# EAGLE design encoder_cable_breakout (EAGLE 7.6.0)
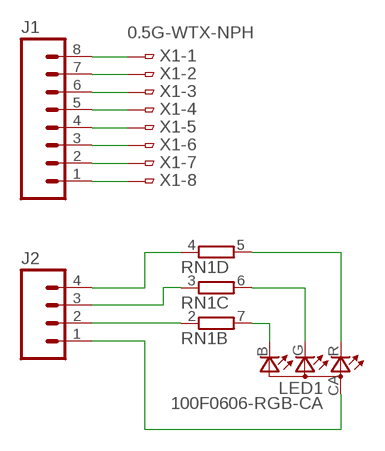
[diagram p0: schematic, sheet 1]

## Parts
J1  M08SILK_FEMALE_PTH  [1X08]
J2  M04PTH  [1X04]
LED1  100F0606-RGB-CA  [1616]
RN1  4R-NYC124  [YC124]
X1  0.5G-WTX-NPH  [0.5G-WTX-NP]

## Nets
N$1: J1.8 X1.1
N$2: J1.7 X1.2
N$3: J1.6 X1.3
N$4: J1.5 X1.4
N$5: J1.4 X1.5
N$6: J1.3 X1.6
N$7: J1.2 X1.7
N$8: J1.1 X1.8
N$9: J2.3 RN1.3
N$10: J2.2 RN1.2
N$11: J2.4 RN1.4
N$12: J2.1 LED1.CA
N$13: LED1.R RN1.5
N$14: LED1.G RN1.6
N$15: LED1.B RN1.7
Unconnected: RN1.1 RN1.8

## Library data of the parts
J1 = SparkFun-Connectors:M08: Header 8 Standard 8-pin 0.1" header. Use with straight break away headers (SKU : PRT-00116), right angle break away headers (PRT-00553), swiss pins (PRT-00743), machine pins (PRT-00117), and female headers (PRT-00115).; PROD_ID: CONN-08438
J2 = SparkFun-Connectors:M04: Header 4 Standard 4-pin 0.1" header. Use with straight break away headers (SKU : PRT-00116), right angle break away headers (PRT-00553), swiss pins (PRT-00743), machine pins (PRT-00117), and female headers (PRT-00115). Molex polarized connector foot print use with SKU : PRT-08231 with associated crimp pins and housings. 1MM SMD Version SKU: PRT-10208; PROD_ID: CONN-09696
LED1 = 100F0606-RGB-CA:100F0606-RGB-CA: Common-anode 1616 RGB LED
RN1 = resistor-dil:4R-N: Array Chip Resistor Source: RS Component / Phycomp; OC_FARNELL: unknown; OC_NEWARK: unknown
X1 = FPC_connector_0.5G-WTX-nP:0.5G-WTX-NP: 0.5mm Pitch 8 Pin Connectors For FPC/FFC; MPN: 0.5G-WTX-nP; OC_FARNELL: 1324540; OC_NEWARK: 34M6152

## Board
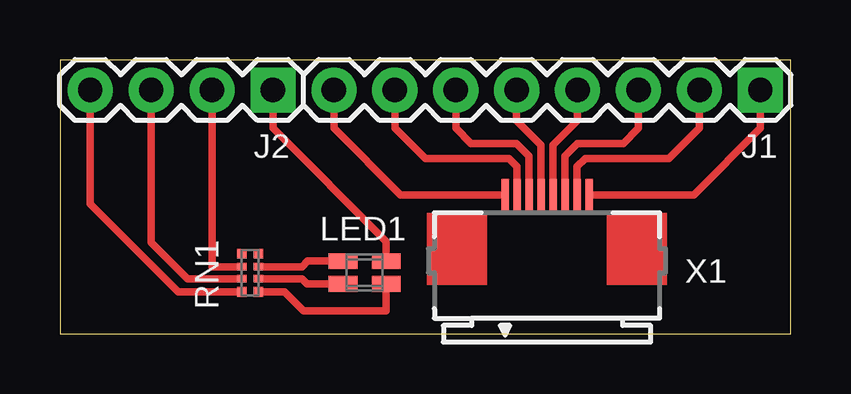
[diagram p1: board, top side]

Size 30.47 x 11.42 mm. Coordinates in mm from the lower left corner, seen from the top.
Outline: 30.47,0 30.47,11.42 0,11.42 0,0 30.47,0
Copper layers (1*16): Top 0.035mm / dielectric 1.5mm / Bottom 0.035mm
Design rules "default": minimum track width 10mil, minimum drill 24mil, track to track 8mil, track to pad 8mil, pad to pad 8mil, via to via 8mil, smd to smd 8mil, copper to edge 40mil, drill to drill 8mil, minimum pad ring 10mil, minimum via ring 8mil, stop-mask expansion 4mil, vias tented up to drill 0mil, thermal gap 10mil

### Footprints (pad centres in the part's own frame; a part is rotated, then mirrored left to right if it is on the bottom)
1X08 = drill 1.016 pad 1.88 square: 1 0,0 | drill 1.016 pad 1.88: 2 2.54,0; 3 5.08,0; 4 7.62,0; 5 10.16,0; 6 12.7,0; 7 15.24,0; 8 17.78,0
1X04 = drill 1.016 pad 1.88 square: 1 0,0 | drill 1.016 pad 1.88: 2 2.54,0; 3 5.08,0; 4 7.62,0
1616 = smd 0.65 x 1.2: B -0.475,-0.9; CA -0.475,0.9; G 0.475,-0.9; R 0.475,0.9
YC124 = smd 0.4 x 0.4: 1 -0.8,-0.35; 4 0.8,-0.35; 5 0.8,0.35; 8 -0.8,0.35 | smd 0.3 x 0.4: 2 -0.25,-0.35; 3 0.25,-0.35; 6 0.25,0.35; 7 -0.25,0.35
0.5G-WTX-NP = smd 0.3 x 1.3: 1 -1.75,3.25; 2 -1.25,3.25; 3 -0.75,3.25; 4 -0.25,3.25; 5 0.25,3.25; 6 0.75,3.25; 7 1.25,3.25; 8 1.75,3.25

### Placement (x,y rotation side)
J1  29.2,10.16 180 top
J2  8.88,10.16 180 top
LED1  12.7,2.55 270 top
RN1  7.93,2.54 270 top
X1  20.31,2.54 0 top

### Tracks (layer width: path | path; a pad name or v marks a point on that pad's centre or on a via)
N$1
  Top 0.305: X1.1 14.2,5.79 11.42,8.57 J1.8
N$2
  Top 0.305: X1.2 19.06,6.96 18.72,7.3 15.23,7.3 13.96,8.57 J1.7
N$3
  Top 0.305: X1.3 19.56,7.42 19.04,7.94 17.14,7.94 16.5,8.57 J1.6
N$4
  Top 0.305: X1.4 20.06,7.87 19.04,8.89 J1.5
N$5
  Top 0.305: X1.5 20.56,7.87 21.58,8.89 J1.4
N$6
  Top 0.305: X1.6 21.06,7.42 21.58,7.94 23.48,7.94 24.12,8.57 J1.3
N$7
  Top 0.305: X1.7 21.56,6.96 21.9,7.3 25.39,7.3 26.66,8.57 J1.2
N$8
  Top 0.305: X1.8 26.42,5.79 29.2,8.57 J1.1
N$9
  Top 0.305: RN1.3 5.32,2.29 3.8,3.81 J2.3
N$10
  Top 0.305: RN1.2 6.34,2.79 J2.2
N$11
  Top 0.305: RN1.4 4.92,1.74 1.26,5.4 J2.4
N$12
  Top 0.305: J2.1 8.88,8.57 13.6,3.85 LED1.CA
N$13
  Top 0.305: RN1.5 9.37,1.74 10.16,0.95 13.6,0.95 LED1.R
N$14
  Top 0.305: RN1.6 10.09,2.29 10.31,2.08 LED1.G
N$15
  Top 0.305: RN1.7 10.09,2.79 10.33,3.02 LED1.B